# Altium schematic sheet powerport.SchDoc
size A4
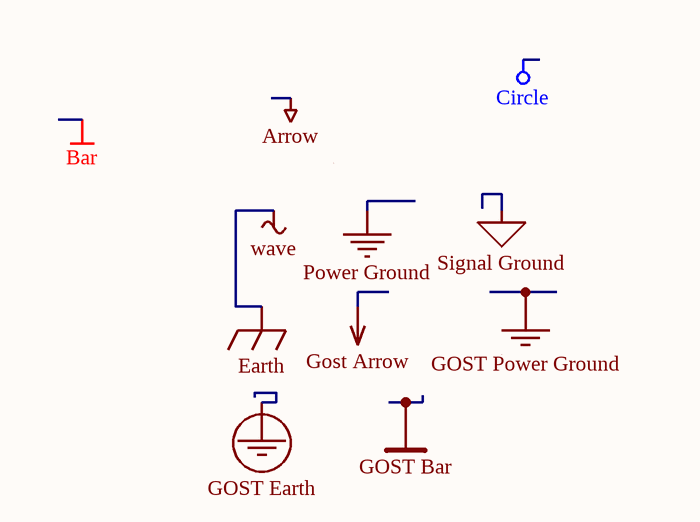
[diagram p0: powerport.SchDoc]